# EAGLE design BAD (EAGLE 7.7.0)
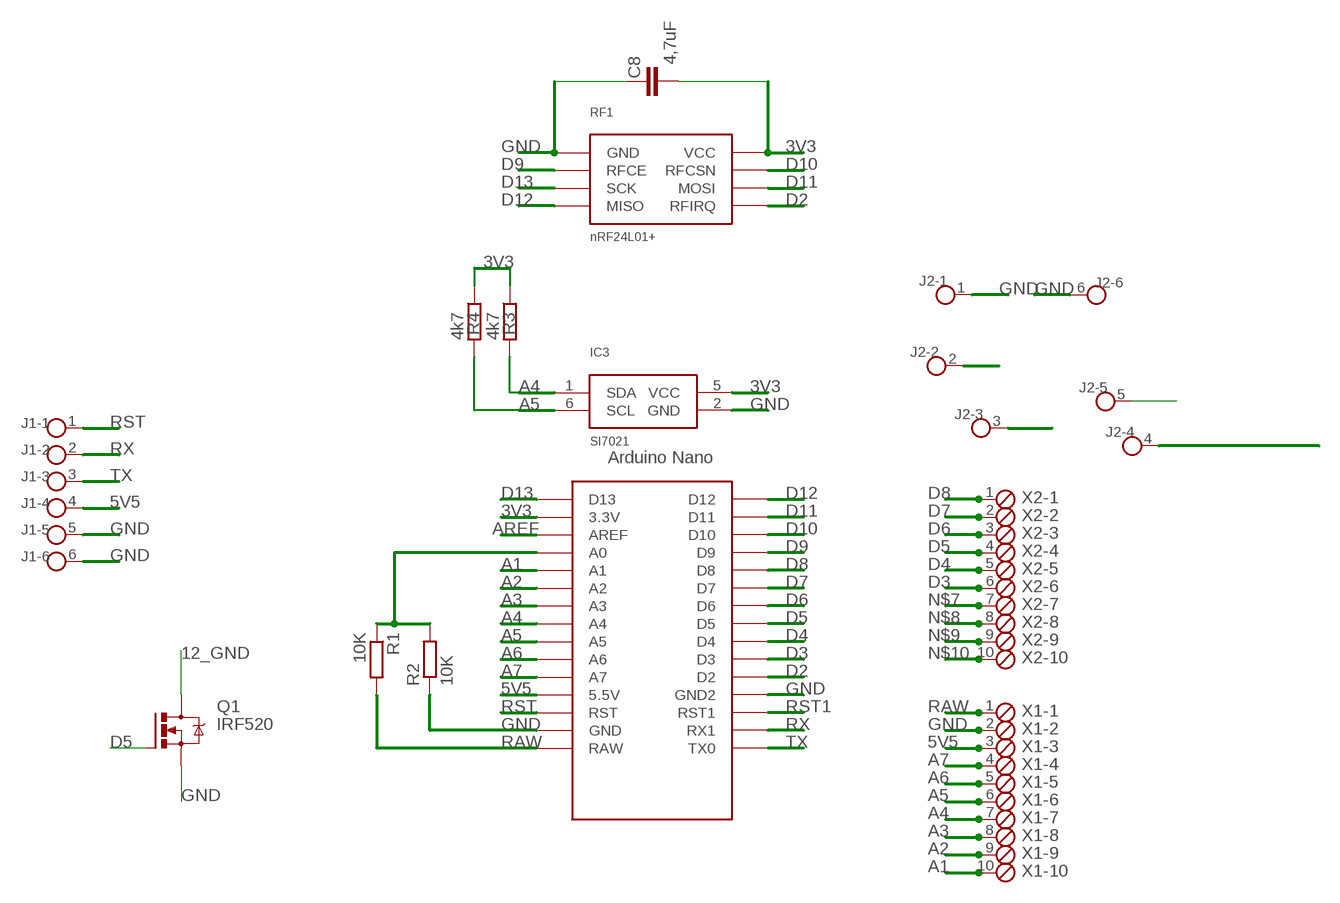
[diagram p0: schematic, sheet 1]

## Parts
C8  4,7uF  C-EUC3216  [C3216]
IC3  SI7021  [DFN6]
J1  FTDI  LIST6LIST6B  [LIST6B]
J2  LIST6  [LIST6]
Q1  IRF520  [TO220BV]
R1  10K  R-EU_R0805  [R0805]
R2  10K  R-EU_R0805  [R0805]
R3  4k7  R-EU_R0805  [R0805]
R4  4k7  R-EU_R0805  [R0805]
RF1  nRF24L01+  NRF24L01  [2X4-2.54MM]
U$1  NANO  [NANO]
X1  MPT10  [10POL254]
X2  MPT10  [10POL254]

## Nets
3V3: C8.1 IC3.5(VCC) J2.2 R3.1 R4.1 RF1.P$2(VCC) U$1.3.3V
5V5: J1.4 J2.3 U$1.5V(5.5V) X1.3
12_GND: J2.5 Q1.D
A1: U$1.A1 X1.10
A2: U$1.A2 X1.9
A3: U$1.A3 X1.8
A4: IC3.1(SDA) R3.2 U$1.A4 X1.7
A5: IC3.6(SCL) R4.2 U$1.A5 X1.6
A6: U$1.A6 X1.5
A7: U$1.A7 X1.4
AREF: U$1.AREF
D2: RF1.P$8(RFIRQ) U$1.D2
D3: U$1.D3 X2.6
D4: U$1.D4 X2.5
D5: Q1.G U$1.D5 X2.4
D6: U$1.D6 X2.3
D7: U$1.D7 X2.2
D8: U$1.D8 X2.1
D9: RF1.P$3(RFCE) U$1.D9
D10: RF1.P$4(RFCSN) U$1.D10
D11: RF1.P$6(MOSI) U$1.D11
D12: RF1.P$7(MISO) U$1.D12
D13: RF1.P$5(SCK) U$1.D13
GND: C8.2 IC3.2(GND) J1.5 J1.6 J2.1 J2.6 Q1.S R2.1 RF1.P$1(GND) U$1.GND U$1.GND1(GND2) X1.2
N$2: R1.1 R2.2 U$1.A0
N$7: X2.7
N$8: X2.8
N$9: X2.9
N$10: X2.10
RAW: J2.4 R1.2 U$1.RAW X1.1
RST: J1.1 U$1.RST
RST1: U$1.RST1
RX: J1.2 U$1.RX1
TX: J1.3 U$1.TX0
Unconnected: U$1.ICSP1 U$1.ICSP2 U$1.ICSP3 U$1.ICSP4 U$1.ICSP5 U$1.ICSP6

## Library data of the parts
C8 = rcl:C-EU: CAPACITOR, European symbol
IC3 = Sensor:SI7021
J1 J2 = CONNLIST:LIST6
Q1 = irf:IRF520: HEXFET Power MOSFET
R1-R4 = rcl:R-EU_: RESISTOR, European symbol
RF1 = matrix:NRF24L01
U$1 = AWP-Lib2:NANO: Arduino Nano
X1 X2 = con-phoenix-254:MPT10: PHOENIX CONNECTOR

## Net classes
0 default: width 0.203 mm

## Board
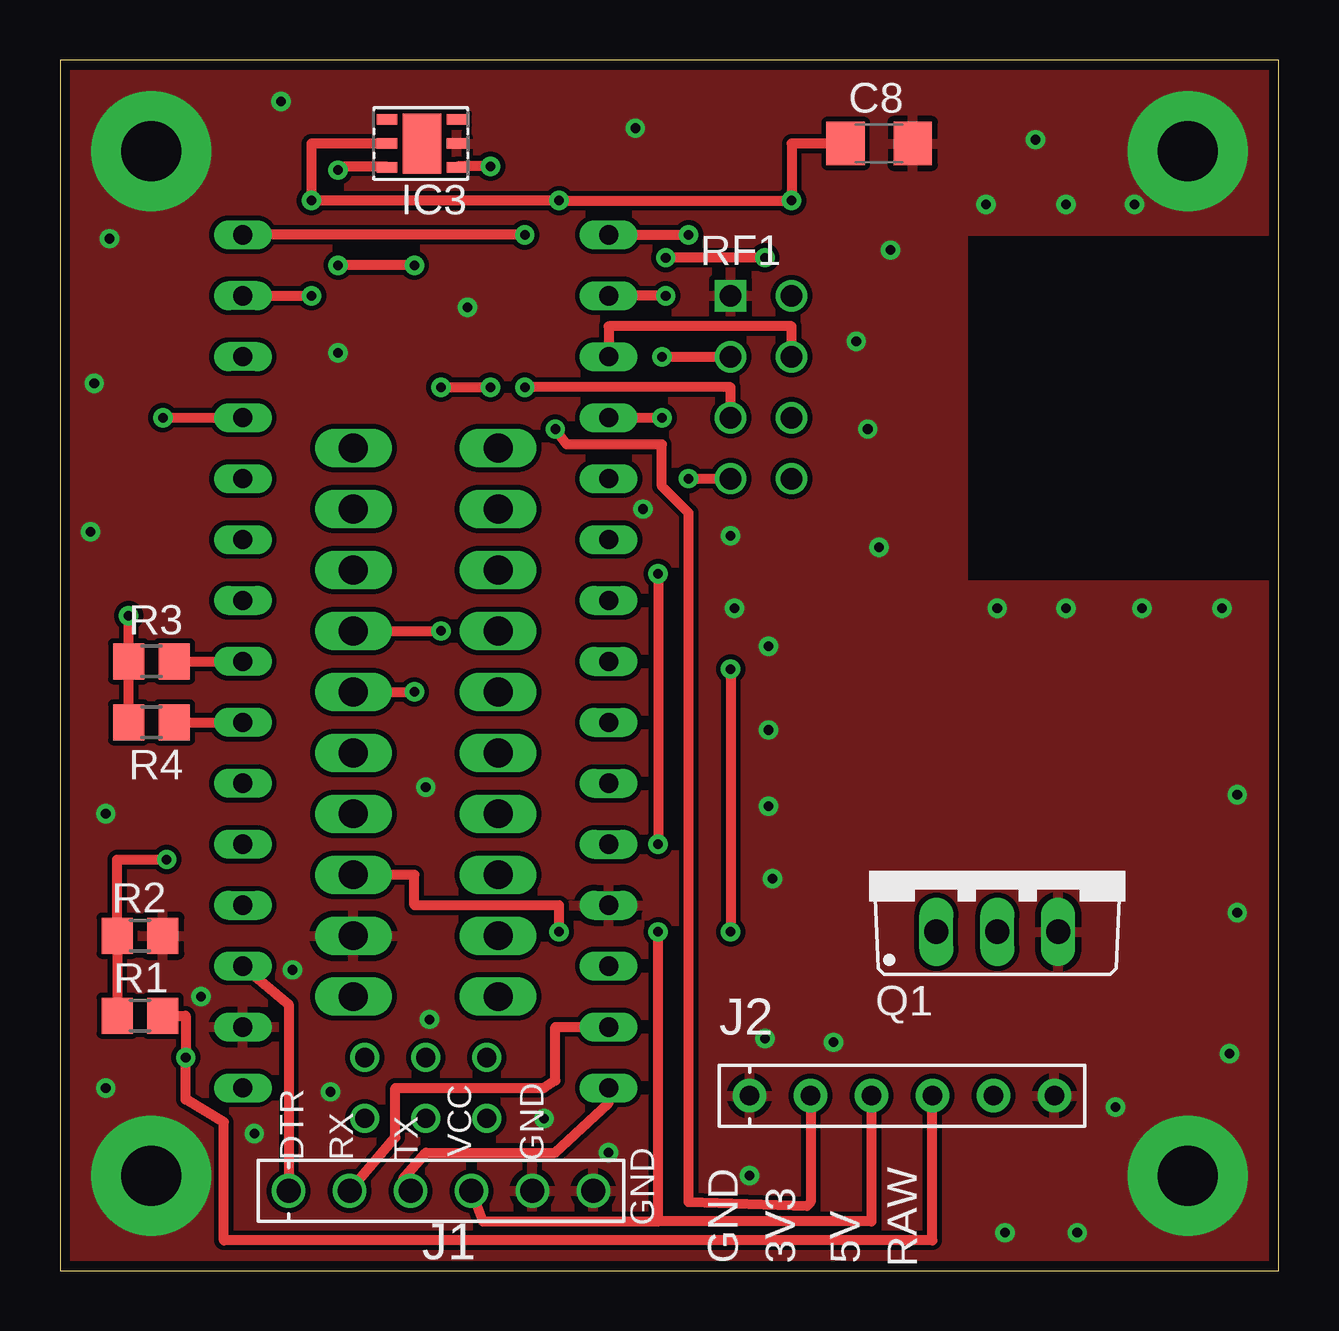
[diagram p1: board, top side]
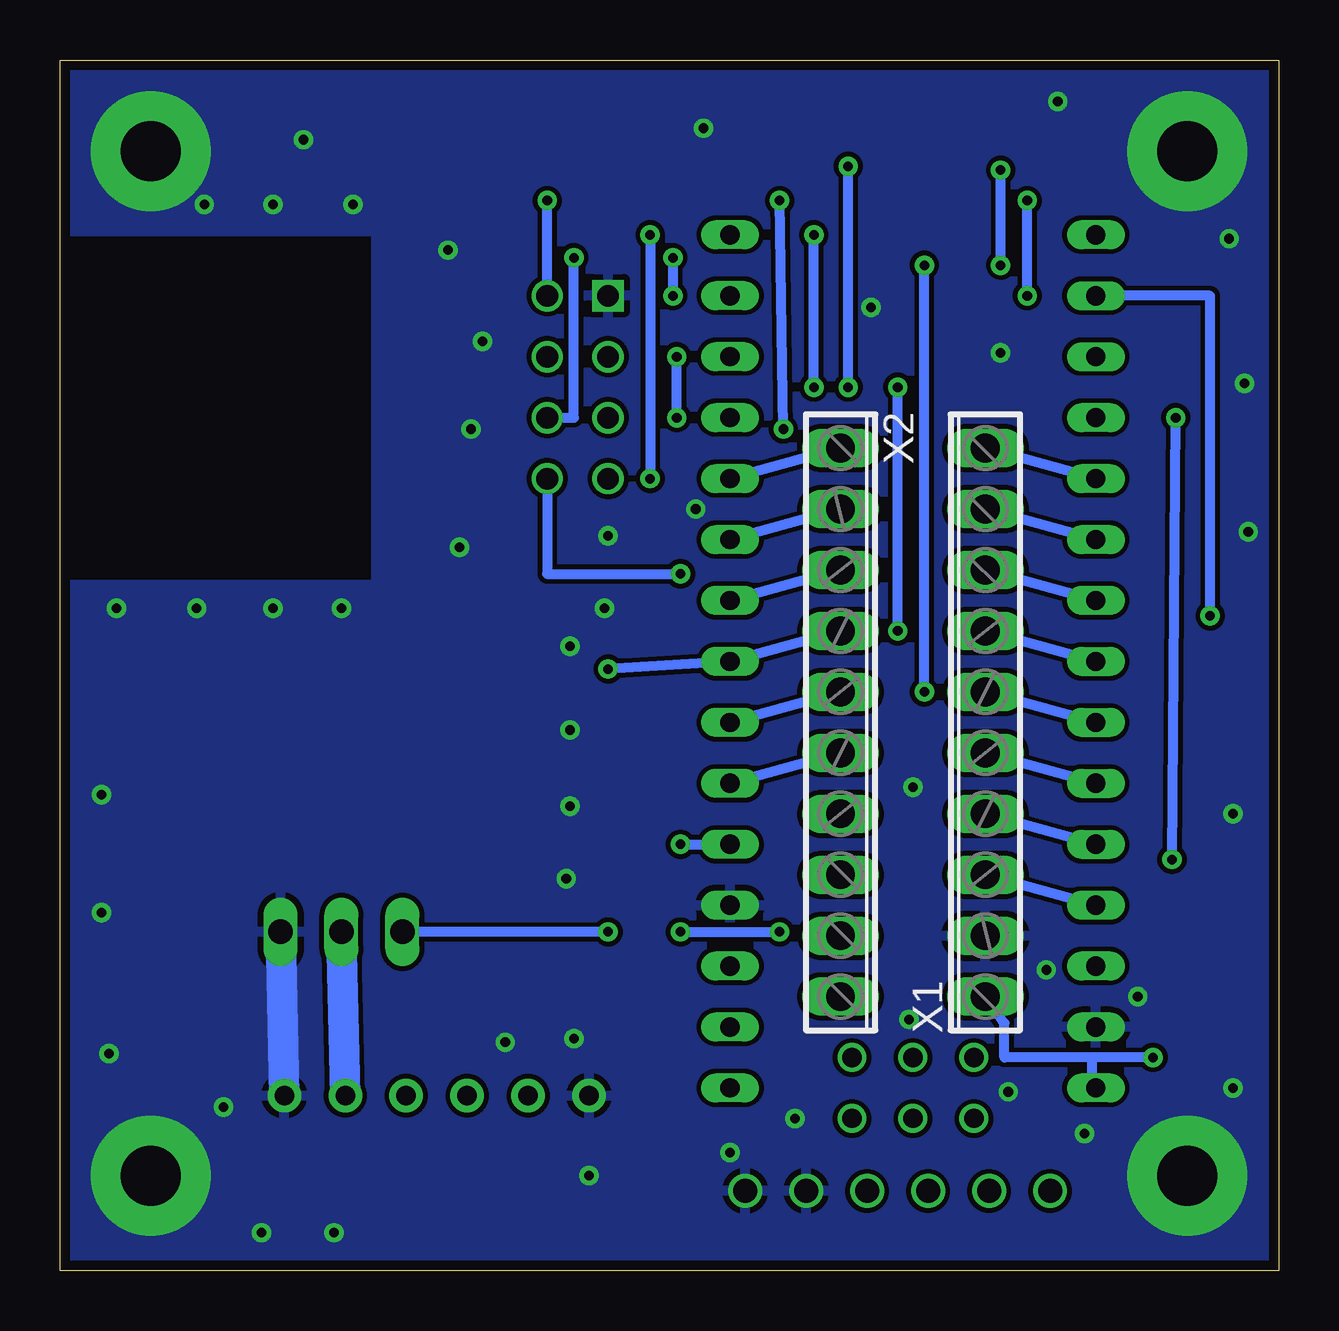
[diagram p2: board, bottom side, seen from below]

Size 50.78 x 50.47 mm. Coordinates in mm from the lower left corner, seen from the top.
Outline: 0,0 50.78,0 50.78,50.47 0,50.47 0,0
Copper layers (1*16): Top 0.035mm / dielectric 1.5mm / Bottom 0.035mm
Design rules "8mil_capinor": minimum track width 4mil, minimum drill 0.2997mm, track to track 8mil, track to pad 8mil, pad to pad 8mil, via to via 8mil, smd to smd 0mil, copper to edge 16mil, drill to drill 16mil, minimum pad ring 8mil, minimum via ring 8mil, stop-mask expansion 0mil, vias tented up to drill 16mil, thermal gap 10mil

### Footprints (pad centres in the part's own frame; a part is rotated, then mirrored left to right if it is on the bottom)
C3216 = smd 1.6 x 1.8: 1 -1.4,0; 2 1.4,0
DFN6 = smd 0.85 x 0.45: 1 -1.45,1; 2 -1.45,0; 3 -1.45,-1; 4 1.45,-1; 5 1.45,0; 6 1.45,1 | smd 1.6 x 2.5: P$1 0,0
LIST6B = drill 1: 1 -6.35,0; 2 -3.81,0; 3 -1.27,0; 4 1.27,0; 5 3.81,0; 6 6.35,0
LIST6 = drill 0.813 pad 1.397: 1 -6.35,0; 2 -3.81,0; 3 -1.27,0; 4 1.27,0; 5 3.81,0; 6 6.35,0
TO220BV = drill 1.016 long: D 0,-2.54; G -2.54,-2.54; S 2.54,-2.54
R0805 = smd 1.3 x 1.5: 1 -0.95,0; 2 0.95,0
2X4-2.54MM = drill 0.9 square: P$1 0,0 | drill 0.9: P$2 2.54,0; P$3 0,-2.54; P$4 2.54,-2.54; P$5 0,-5.08; P$6 2.54,-5.08; P$7 0,-7.62; P$8 2.54,-7.62
NANO = drill 0.8 long: 3.3V -10.16,24.13; 5V -10.16,-1.27; A0 -10.16,19.05; A1 -10.16,16.51; A2 -10.16,13.97; A3 -10.16,11.43; A4 -10.16,8.89; A5 -10.16,6.35; A6 -10.16,3.81; A7 -10.16,1.27; AREF -10.16,21.59; D2 5.08,1.27; D3 5.08,3.81; D4 5.08,6.35; D5 5.08,8.89; D6 5.08,11.43; D7 5.08,13.97; D8 5.08,16.51; D9 5.08,19.05; D10 5.08,21.59; D11 5.08,24.13; D12 5.08,26.67; D13 -10.16,26.67; GND -10.16,-6.35; GND1 5.08,-1.27; RAW -10.16,-8.89; RST -10.16,-3.81; RST1 5.08,-3.81; RX1 5.08,-6.35; TX0 5.08,-8.89 | drill 0.8: ICSP1 -5.08,-10.16; ICSP2 -5.08,-7.62; ICSP3 -2.54,-10.16; ICSP4 -2.54,-7.62; ICSP5 0,-10.16; ICSP6 0,-7.62
10POL254 = drill 1.2 long: 1 -11.43,0; 2 -8.89,0; 3 -6.35,0; 4 -3.81,0; 5 -1.27,0; 6 1.27,0; 7 3.81,0; 8 6.35,0; 9 8.89,0; 10 11.43,0

### Placement (x,y rotation side)
C8  34.13,46.99 0 top
IC3  15.08,46.99 180 top
J1  15.88,3.33 0 top
J2  35.08,7.3 0 top
Q1  39.05,16.67 0 top
R1  3.33,10.64 0 top
R2  3.33,13.97 180 top
R3  3.81,25.4 0 top
R4  3.81,22.86 0 top
RF1  27.94,40.64 0 top
U$1  17.78,16.51 0 top
X1  12.22,22.86 90 bottom
X2  18.26,22.86 270 bottom

### Tracks (layer width: path | path; a pad name or v marks a point on that pad's centre or on a via)
3V3  (via drill 0.4)
  Top 0.406: U$1.3.3V v10.48,40.64 | R4.1 R3.1 v2.86,27.3 | IC3.5 10.48,46.99 v10.48,44.61 v20.8,44.61 v30.48,44.61 30.48,46.99 C8.1 | J2.2 31.27,2.86 31.11,2.7 26.19,2.86 26.19,31.59 25.08,32.7 25.08,34.45 21.11,34.45 v20.64,35.08
  Bottom 0.406: RF1.P$2 v30.48,44.61 | v10.48,40.64 v10.48,44.61 | v2.86,27.3 2.86,40.64 U$1.3.3V | v20.64,35.08 v20.8,44.61
5V5  (via drill 0.4)
  Top 0.406: 24.92,2.06 33.81,2.06 J2.3 | 24.92,2.06 v24.92,14.13 | v20.8,14.13 20.8,15.24 14.76,15.24 14.76,16.51 X1.3 | J1.4 17.62,2.06 24.92,2.06
  Bottom 0.406: U$1.5V X1.3 | v24.92,14.13 v20.8,14.13
12_GND
  Bottom 1.27: J2.5 Q1.D
A1
  Bottom 0.406: U$1.A1 X1.10
A2
  Bottom 0.406: U$1.A2 X1.9
A3
  Bottom 0.406: U$1.A3 X1.8
A4  (via drill 0.4)
  Top 0.406: R3.2 U$1.A4 | X1.7 v15.88,26.67 | v15.88,36.83 v17.94,36.83 | v17.94,46.04 16.58,46.04 IC3.1
  Bottom 0.406: U$1.A4 X1.7 | v15.88,26.67 v15.88,36.83 | v17.94,36.83 v17.94,46.04
A5  (via drill 0.4)
  Top 0.406: R4.2 U$1.A5 | X1.6 v14.76,24.13 | v14.76,41.91 v11.59,41.91 | v11.59,45.88 11.75,46.04 13.58,46.04 IC3.6
  Bottom 0.406: U$1.A5 X1.6 | v14.76,24.13 v14.76,41.91 | v11.59,41.91 v11.59,45.88
A6
  Bottom 0.406: U$1.A6 X1.5
A7
  Bottom 0.406: U$1.A7 X1.4
D2  (via drill 0.4)
  Top 0.406: v24.92,29.05 v24.92,17.78
  Bottom 0.406: RF1.P$8 30.48,29.05 v24.92,29.05 | v24.92,17.78 U$1.D2
D3
  Bottom 0.406: X2.6 U$1.D3
D4
  Bottom 0.406: X2.5 U$1.D4
D5  (via drill 0.4)
  Top 0.406: v27.94,25.08 v27.94,14.13
  Bottom 0.406: X2.4 U$1.D5 v27.94,25.08 | v27.94,14.13 Q1.G
D6
  Bottom 0.406: X2.3 U$1.D6
D7
  Bottom 0.406: X2.2 U$1.D7
D8
  Bottom 0.406: X2.1 U$1.D8
D9  (via drill 0.4)
  Top 0.406: U$1.D9 v25.08,35.56 | v25.08,38.1 RF1.P$3
  Bottom 0.406: v25.08,35.56 v25.08,38.1
D10
  Top 0.406: RF1.P$4 30.48,39.37 22.86,39.37 U$1.D10
D11  (via drill 0.4)
  Top 0.406: v29.37,42.23 v25.24,42.23 | v25.24,40.64 U$1.D11
  Bottom 0.406: RF1.P$6 29.37,35.56 v29.37,42.23 | v25.24,42.23 v25.24,40.64
D12  (via drill 0.4)
  Top 0.406: U$1.D12 v26.19,43.18 | v26.19,33.02 RF1.P$7 28.1,33.02
  Bottom 0.406: v26.19,43.18 v26.19,33.02
D13  (via drill 0.4)
  Top 0.406: RF1.P$5 27.94,36.83 v19.37,36.83 | v19.37,43.18 U$1.D13
  Bottom 0.406: v19.37,36.83 v19.37,43.18
GND  (via drill 0.4, 2.5 pad 5)
  Bottom 1.27: Q1.S J2.6
  other vias: 3.81,3.97 46.99,3.97 46.99,46.67 3.81,46.67 33.18,38.73 33.66,35.08 34.13,30.16 34.61,42.55 40.64,47.15 38.58,44.45 41.91,44.45 44.77,44.45 23.97,47.62 9.21,48.74 2.06,43.02 1.43,36.99 1.27,30.8 1.91,19.05 11.59,38.26 16.99,40.16 24.29,31.75 1.91,7.62 8.1,5.71 22.86,4.92 39.05,27.62 41.91,27.62 45.09,27.62 48.42,27.62 15.4,10.48 15.24,20.16 11.27,7.46 39.37,1.59 42.39,1.59 43.97,6.83 48.74,9.05 49.05,14.92 49.05,19.84 5.87,11.43 9.68,12.54 27.94,30.64 20.16,6.35 28.1,27.62 29.53,26.03 29.53,22.54 29.53,19.37 29.69,16.35 29.37,9.68 32.23,9.52 28.73,3.97
  pour Bottom: 0,50.48 50.8,50.48 50.8,43.34 37.62,43.34 37.62,28.58 50.8,28.58 50.8,0 0,0
  pour Top: 0,50.48 50.8,50.48 50.8,43.34 37.62,43.34 37.62,28.58 50.8,28.58 50.8,0 0,0
N$2  (via drill 0.4)
  Top 0.406: v4.45,17.14 2.38,17.14 R2.2 R1.1 | v4.29,35.56 U$1.A0
  Bottom 0.406: v4.45,17.14 v4.29,35.56
RAW  (via drill 0.4)
  Top 0.406: R1.2 5.24,10.64 v5.24,8.89 5.24,7.14 6.83,6.19 6.83,1.27 36.35,1.27 J2.4
  Bottom 0.406: v5.24,8.89 7.78,8.89 | 7.78,8.89 11.43,8.89 11.43,10.32 X1.1 | U$1.RAW 7.78,7.62 7.78,8.89
RST
  Top 0.406: U$1.RST 9.53,11.11 J1.1
RX
  Top 0.406: J1.2 13.97,5.56 13.97,7.62 20.16,7.62 20.64,7.94 20.64,10.16 U$1.RX1
TX
  Top 0.406: J1.3 14.29,3.81 15.24,4.92 20.64,4.92 22.86,6.98 U$1.TX0

### Text on the board
tNames: GND | 3V3 | 5V | RAW
_tsilk: DTR | RX | TX | VCC | GND | GND
_tNames: GND